# Altium schematic sheet Main_2026-02-16.schdoc
size 563 x 357 mm
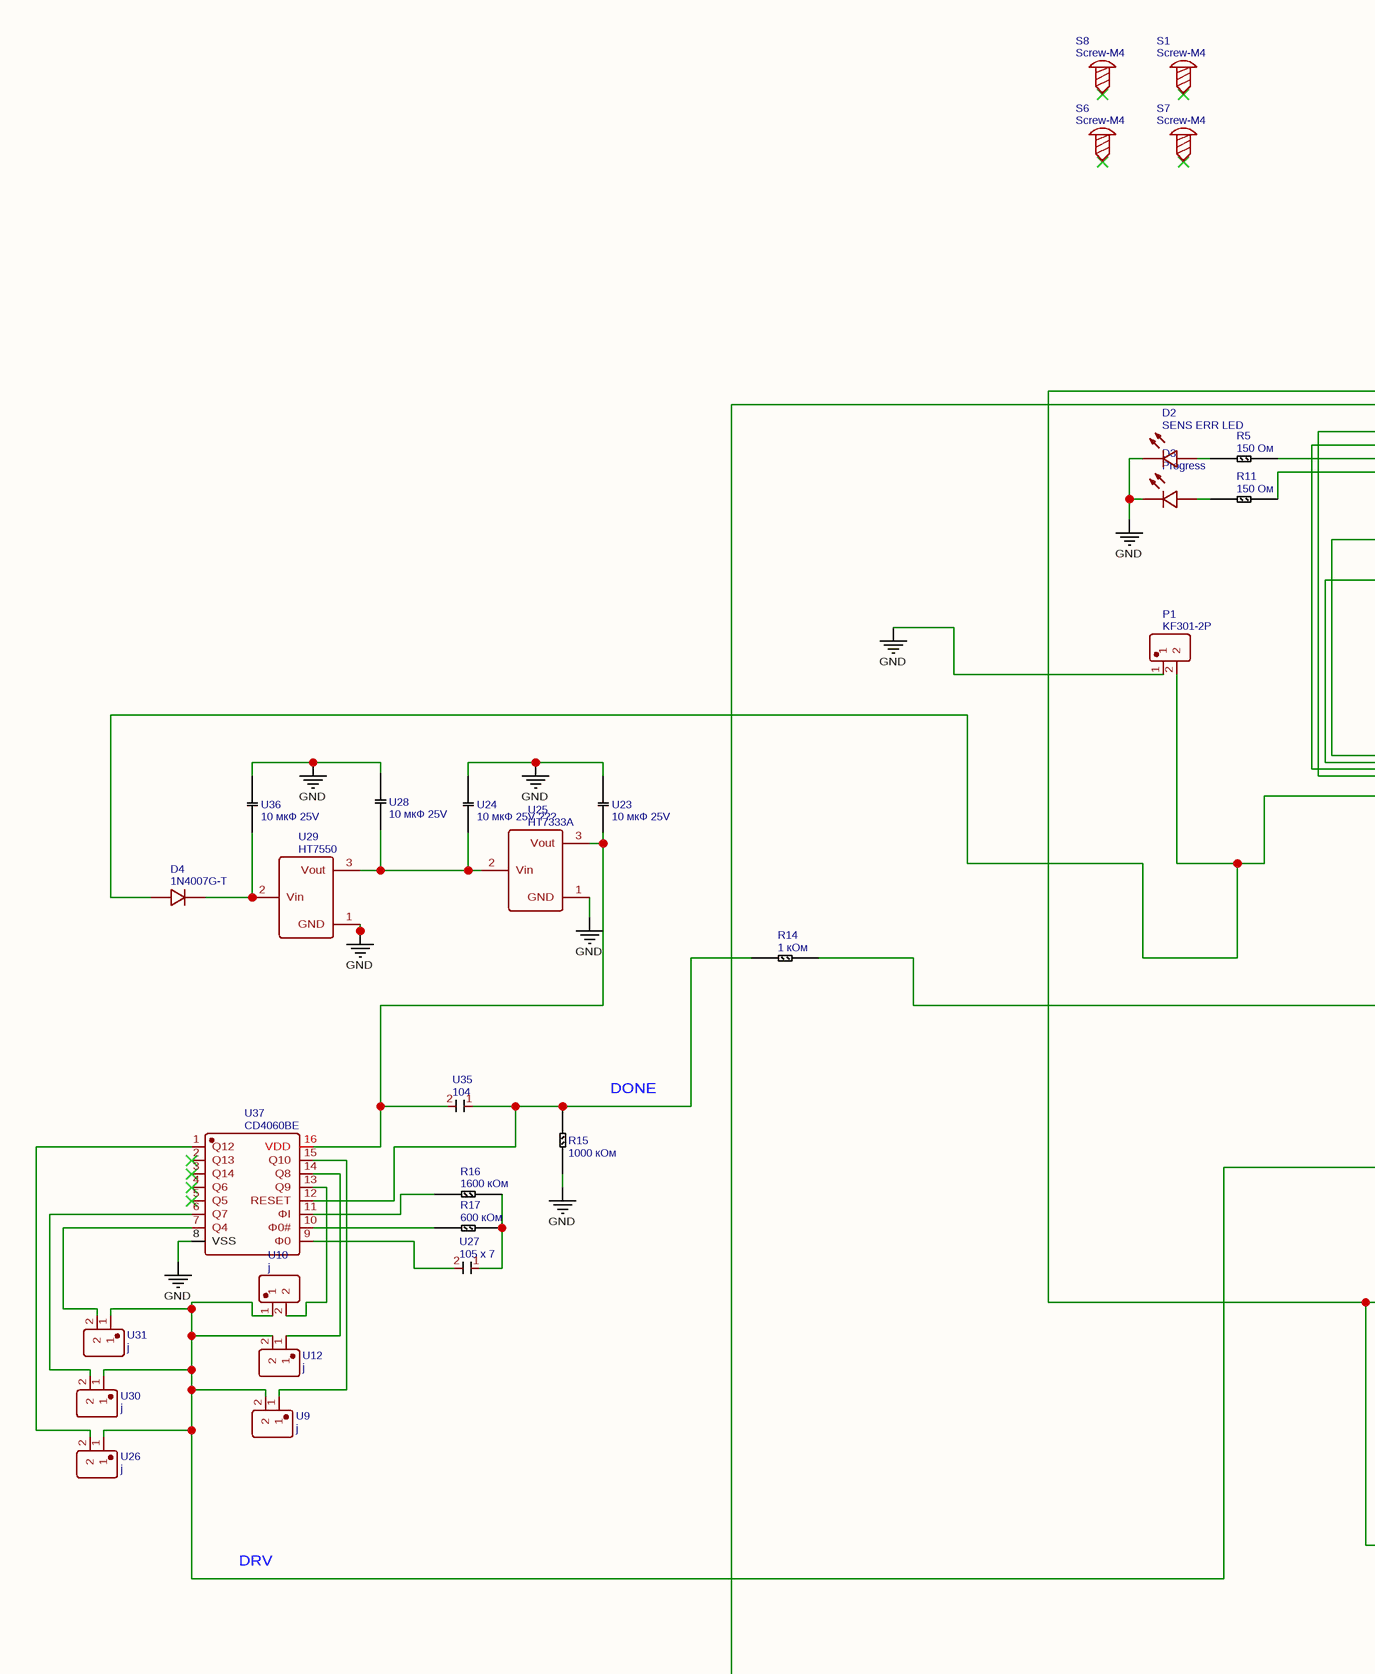
[diagram p0: Main_2026-02-16.schdoc, left]
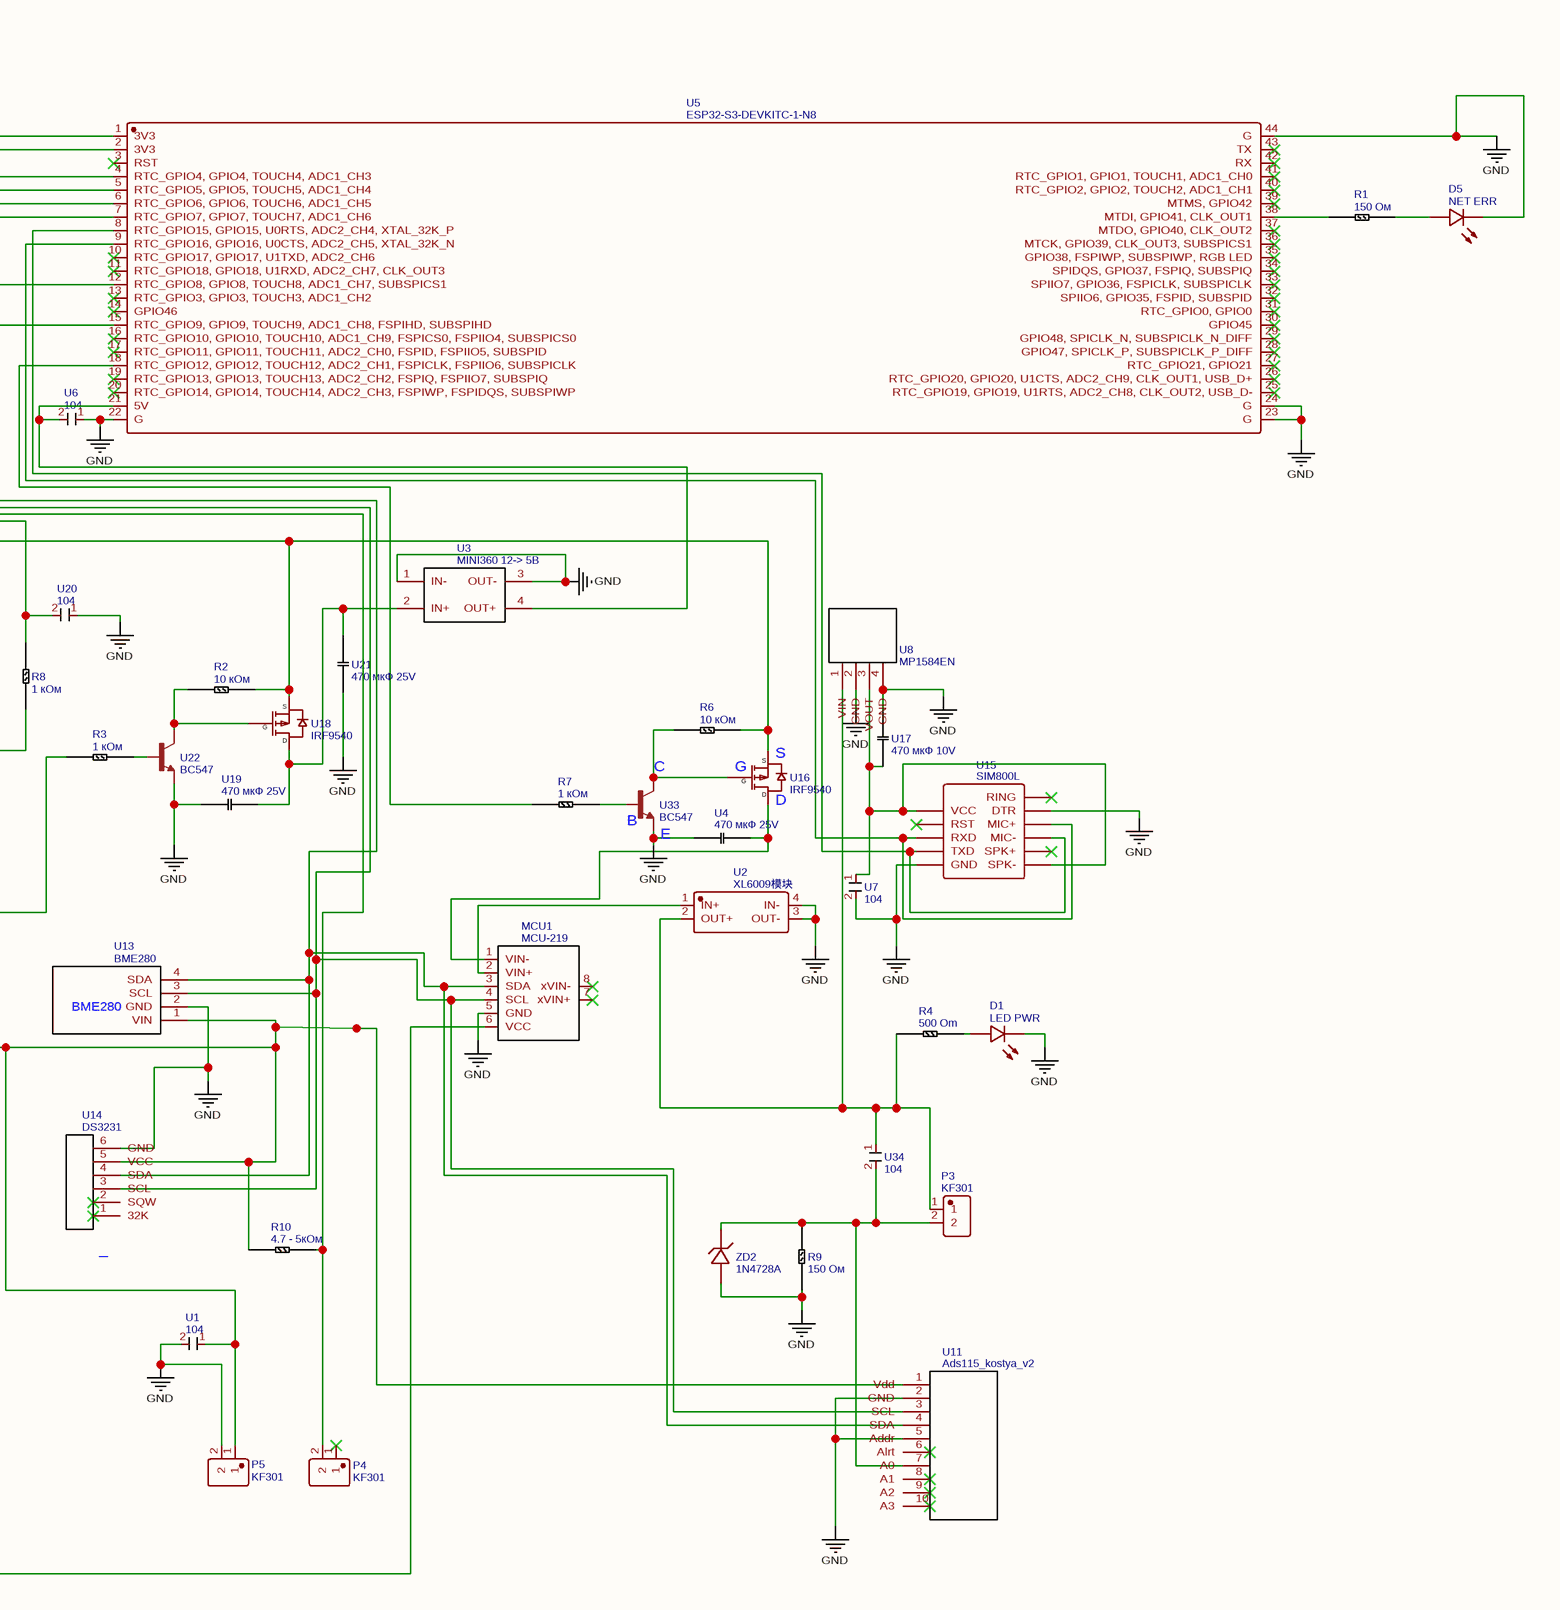
[diagram p1: Main_2026-02-16.schdoc, right]

## Parts
D1  LED PWR  [LED-TH_LED-DP2-2LED-AMCC]
D2  SENS ERR LED  [LED-TH_LED-DP2-2LED-AMCC]
D3  Progress  [LED-TH_LED-DP2-2LED-AMCC]
D4  1N4007G-T  [DO-41_BD2.4-L4.7-P8.70-D0.9-RD]
D5  NET ERR  [LED-TH_LED-DP2-2LED-AMCC]
MCU1  MCU-219  [MCU-219]
P1  KF301-2P  [CONN-TH_XY301V-A-5.0-2P]
P3  KF301  [CONN-TH_XY301V-A-5.0-2P]
P4  KF301  [CONN-TH_XY301V-A-5.0-2P]
P5  KF301  [CONN-TH_XY301V-A-5.0-2P]
R1  150 Ом  [R_0_125]
R2  10 кОм  [R_0_125]
R3  1 кОм  [R_0_125]
R4  500 Om  [R_0_125]
R5  150 Ом  [R_0_125]
R6  10 кОм  [R_0_125]
R7  1 кОм  [R_0_125]
R8  1 кОм  [R_0_125]
R9  150 Ом  [R_0_125]
R10  4.7 - 5кОм  [R_0_125]
R11  150 Ом  [R_0_125]
R14  1 кОм  [R_0_125]
R15  1000 кОм  [R_0_125]
R16  1600 кОм  [R_0_125]
R17  600 кОм  [R_0_125]
S1  Screw-M4  [SCREW-M4]
S6  Screw-M4  [SCREW-M4]
S7  Screw-M4  [SCREW-M4]
S8  Screw-M4  [SCREW-M4]
U1  104  [104]
U2  XL6009模块  [XFMR-SMD_XL6009]
U3  MINI360 12-> 5В  [MINI360BUCK]
U4  470 мкФ 25V  [C_]
U5  ESP32-S3-DEVKITC-1-N8  [CONN-TH_ESP32-S3-DEVKITC-1U-N8]
U6  104  [104]
U7  104  [104]
U8  MP1584EN  [MP1584EN]
U9  j  [HDR-TH_2P-P2.54-V-M-1]
U10  j  [HDR-TH_2P-P2.54-V-M-1]
U11  Ads115_kostya_v2  [ADS1115_KOSTYA_V2]
U12  j  [HDR-TH_2P-P2.54-V-M-1]
U13  BME280  [BME280]
U14  DS3231  [DS3231]
U15  SIM800L  [SIM800L]
U16  IRF9540  [IRF9540]
U17  470 мкФ 10V  [C_]
U18  IRF9540  [IRF9540]
U19  470 мкФ 25V  [C_]
U20  104  [104]
U21  470 мкФ 25V  [C_]
U22  BC547  [BC547 (2)]
U23  10 мкФ 25V  [C_]
U24  10 мкФ 25V ???  [C_]
U25  HT7333A  [TO-92-3_L4.9-W3.7-P1.27-L]
U26  j  [HDR-TH_2P-P2.54-V-M-1]
U27  105 x 7  [104]
U28  10 мкФ 25V  [C_]
U29  HT7550  [TO-92-3_L4.9-W3.7-P1.27-L]
U30  j  [HDR-TH_2P-P2.54-V-M-1]
U31  j  [HDR-TH_2P-P2.54-V-M-1]
U33  BC547  [BC547 (2)]
U34  104  [104]
U35  104  [104]
U36  10 мкФ 25V  [C_]
U37  CD4060BE  [PDIP-16_L19.3-W6.5-P2.54-LS7.6-BL]
ZD2  1N4728A  [DO-41_BD2.8-L4.2-P8.00-D0.7-FD]

## Nets
GND: D1.2(K) D2.2(K) D3.2(K) D5.2(K) MCU1.5(GND) P1.1 P5.2 R9.2 R15.1 U1.2 U2.3(OUT-) U2.4(IN-) U3.1(IN-) U3.3(OUT-) U4.1 U5.22(G) U5.23(G) U5.24(G) U5.44(G) U6.1 U7.2 U8.2(GND) U8.4(GND) U11.2(GND) U11.5(Addr) U13.2(GND) U14.6(GND) U15.5(GND) U15.10(DTR) U17.1 U19.1 U20.1 U21.2 U22.3(E) U23.1 U24.1 U25.1(GND) U28.2 U29.1(GND) U33.3(E) U36.1 U37.8(VSS) ZD2.1(A)
NetD1_1: D1.1(A) R4.1
NetD2_1: D2.1(A) R5.1
NetD3_1: D3.1(A) R11.1
NetD4_1: D4.1(K) U29.2(Vin) U36.2
NetD4_2: D4.2(A) P1.2 R2.2 R6.2 U16.3(S) U18.3(S)
NetD5_1: D5.1(A) R1.2
NetMCU1_1: MCU1.1(VIN-) U4.2 U16.2(D)
NetMCU1_2: MCU1.2(VIN+) U2.1(IN+)
NetMCU1_3: MCU1.3(SDA) MCU1.4(SCL) P4.2 R8.1 R10.1 R11.2 U5.4(RTC_GPIO4,_GPIO4,_TOUCH4,_ADC1_CH3) U5.5(RTC_GPIO5,_GPIO5,_TOUCH5,_ADC1_CH4) U5.7(RTC_GPIO7,_GPIO7,_TOUCH7,_ADC1_CH6) U5.12(RTC_GPIO8,_GPIO8,_TOUCH8,_ADC1_CH7,_SUBSPICS1) U5.15(RTC_GPIO9,_GPIO9,_TOUCH9,_ADC1_CH8,_FSPIHD,_SUBSPIHD) U11.3(SCL) U11.4(SDA) U13.3(SCL) U13.4(SDA) U14.3(SCL) U14.4(SDA) U20.2
NetMCU1_6: MCU1.6(VCC) U5.2(3V3)
NetP3_1: P3.1 R4.2 U2.2(OUT+) U8.1(VIN) U34.1
NetP3_2: P3.2 R9.1 U11.7(A0) U34.2 ZD2.2(K)
NetP5_1: P5.1 R10.2 U1.1 U5.1(3V3) U11.1(Vdd) U13.1(VIN) U14.5(VCC)
NetR1_1: R1.1 U5.38(MTDI,_GPIO41,_CLK_OUT1)
NetR2_1: R2.1 U18.1(G) U22.1(C)
NetR3_1: R3.1 U9.2 U10.1 U12.2 U26.1 U30.1 U31.1
NetR3_2: R3.2 U22.2(B)
NetR5_2: R5.2 U5.6(RTC_GPIO6,_GPIO6,_TOUCH6,_ADC1_CH5)
NetR6_1: R6.1 U16.1(G) U33.1(C)
NetR7_1: R7.1 U5.18(RTC_GPIO12,_GPIO12,_TOUCH12,_ADC2_CH1,_FSPICLK,_FSPIIO6,_SUBSPICLK)
NetR7_2: R7.2 U33.2(B)
NetR8_2: R8.2 R14.2
NetR14_1: R14.1 R15.2 U35.1 U37.12(RESET)
NetR16_1: R16.1 U37.11(ΦI)
NetR16_2: R16.2 R17.2 U27.1
NetR17_1: R17.1 U37.10(Φ0#)
NetU3_2: U3.2(IN+) U18.2(D) U19.2 U21.1
NetU3_4: U3.4(OUT+) U5.21(5V) U6.2
NetU5_8: U5.8(RTC_GPIO15,_GPIO15,_U0RTS,_ADC2_CH4,_XTAL_32K_P) U15.4(TXD) U15.8(MIC-)
NetU5_9: U5.9(RTC_GPIO16,_GPIO16,_U0CTS,_ADC2_CH5,_XTAL_32K_N) U15.3(RXD) U15.9(MIC+)
NetU7_1: U7.1 U8.3(VOUT) U15.1(VCC) U15.6(SPK-) U17.2
NetU9_1: U9.1 U37.15(Q10)
NetU10_2: U10.2 U37.13(Q9)
NetU12_1: U12.1 U37.14(Q8)
NetU23_2: U23.2 U25.3(Vout) U35.2 U37.16(VDD)
NetU24_2: U24.2 U25.2(Vin) U28.1 U29.3(Vout)
NetU26_2: U26.2 U37.1(Q12)
NetU27_2: U27.2 U37.9(Φ0)
NetU30_2: U30.2 U37.6(Q7)
NetU31_2: U31.2 U37.7(Q4)

Not connected (* = marked no-connect by the designer): MCU1 7(xVIN+)* 8(xVIN-)*; P4 1*; S1 1*; S6 1*; S7 1*; S8 1*; U5 3(RST)* 10(RTC_GPIO17,_GPIO17,_U1TXD,_ADC2_CH6)* 11(RTC_GPIO18,_GPIO18,_U1RXD,_ADC2_CH7,_CLK_OUT3)* 13(RTC_GPIO3,_GPIO3,_TOUCH3,_ADC1_CH2)* 14(GPIO46)* 16(RTC_GPIO10,_GPIO10,_TOUCH10,_ADC1_CH9,_FSPICS0,_FSPIIO4,_SUBSPICS0)* 17(RTC_GPIO11,_GPIO11,_TOUCH11,_ADC2_CH0,_FSPID,_FSPIIO5,_SUBSPID)* 19(RTC_GPIO13,_GPIO13,_TOUCH13,_ADC2_CH2,_FSPIQ,_FSPIIO7,_SUBSPIQ)* 20(RTC_GPIO14,_GPIO14,_TOUCH14,_ADC2_CH3,_FSPIWP,_FSPIDQS,_SUBSPIWP)* 25(RTC_GPIO19,_GPIO19,_U1RTS,_ADC2_CH8,_CLK_OUT2,_USB_D-)* 26(RTC_GPIO20,_GPIO20,_U1CTS,_ADC2_CH9,_CLK_OUT1,_USB_D+)* 27(RTC_GPIO21,_GPIO21)* 28(GPIO47,_SPICLK_P,_SUBSPICLK_P_DIFF)* 29(GPIO48,_SPICLK_N,_SUBSPICLK_N_DIFF)* 30(GPIO45)* 31(RTC_GPIO0,_GPIO0)* 32(SPIIO6,_GPIO35,_FSPID,_SUBSPID)* 33(SPIIO7,_GPIO36,_FSPICLK,_SUBSPICLK)* 34(SPIDQS,_GPIO37,_FSPIQ,_SUBSPIQ)* 35(GPIO38,_FSPIWP,_SUBSPIWP,_RGB_LED)* 36(MTCK,_GPIO39,_CLK_OUT3,_SUBSPICS1)* 37(MTDO,_GPIO40,_CLK_OUT2)* 39(MTMS,_GPIO42)* 40(RTC_GPIO2,_GPIO2,_TOUCH2,_ADC1_CH1)* 41(RTC_GPIO1,_GPIO1,_TOUCH1,_ADC1_CH0)* 42(RX)* 43(TX)*; U11 6(Alrt)* 8(A1)* 9(A2)* 10(A3)*; U14 1(32K)* 2(SQW)*; U15 2(RST)* 7(SPK+)* 11(RING)*; U37 2(Q13)* 3(Q14)* 4(Q6)* 5(Q5)*

## Notes on the sheet
- (near U33) C
- (near U16) G
- (near U16) S
- DONE
- (near U33) B
- (near U33) E
- (near U16) D
- DRV
- (in symbol DS3231) _

## Library data of the parts
D1 = LED PWR: Manufacturer: VccLite; Manufacturer Part: 5600; Contributor: urbanturban; Package Display: No; Supplier: Digi-Key; Supplier Part: L20325-ND; link: https://vcclite.com/product/5602f5-5v/; spicePre: D; spiceSymbolName: LED
D2 = SENS ERR LED: Manufacturer: VccLite; Manufacturer Part: 5600; Contributor: urbanturban; Package Display: No; Supplier: Digi-Key; Supplier Part: L20325-ND; link: https://vcclite.com/product/5602f5-5v/; spicePre: D; spiceSymbolName: LED
D3 = Progress: Manufacturer: VccLite; Manufacturer Part: 5600; Contributor: urbanturban; Package Display: No; Supplier: Digi-Key; Supplier Part: L20325-ND; link: https://vcclite.com/product/5602f5-5v/; spicePre: D; spiceSymbolName: LED
D4 = 1N4007G-T: Manufacturer: DIODES(美台); Contributor: LCSC; Supplier: LCSC; Supplier Part: C516593; Manufacturer Part: 1N4007G-T; JLCPCB Part Class: Extended Part; spicePre: D; spiceSymbolName: 1N4007G-T
D5 = NET ERR: Manufacturer: VccLite; Manufacturer Part: 5600; Contributor: urbanturban; Package Display: No; Supplier: Digi-Key; Supplier Part: L20325-ND; link: https://vcclite.com/product/5602f5-5v/; spicePre: D; spiceSymbolName: LED
MCU1 = MCU-219: Contributor: ziclope; spicePre: M; spiceSymbolName: MCU-219
P1 = KF301-2P: Manufacturer: null; Manufacturer Part: KF301-2P接线端子; Contributor: lcsc; Supplier: LCSC; Supplier Part: C9900016950; JLCPCB Part Class: Extended Part; spicePre: P; spiceSymbolName: KF301-2P VCC Y GND
P3-P5 = KF301: Manufacturer: null; Manufacturer Part: KF301-2P接线端子; Contributor: lcsc; Supplier: LCSC; Supplier Part: C9900016950; JLCPCB Part Class: Extended Part; spicePre: P; spiceSymbolName: KF301-2P VCC Y GND
R1 R5 R9 R11 = 150 Ом: Contributor: verdenum; spicePre: U; spiceSymbolName: R_
R2 R6 = 10 кОм: Contributor: verdenum; spicePre: U; spiceSymbolName: R_
R3 R7 R8 R14 = 1 кОм: Contributor: verdenum; spicePre: U; spiceSymbolName: R_
R4 = 500 Om: Contributor: verdenum; spicePre: U; spiceSymbolName: R_
R10 = 4.7 - 5кОм: Contributor: verdenum; spicePre: U; spiceSymbolName: R_
R15 = 1000 кОм: Contributor: verdenum; spicePre: U; spiceSymbolName: R_
R16 = 1600 кОм: Contributor: verdenum; spicePre: U; spiceSymbolName: R_
R17 = 600 кОм: Contributor: verdenum; spicePre: U; spiceSymbolName: R_
S1 S6-S8 = Screw-M4: Contributor: EasyEDA; spicePre: S; spiceSymbolName: Screw-M4
U1 U6 U7 U20 U34 U35 = 104: Manufacturer: Fe; Contributor: Guest; Manufacturer Part: 104; Supplier Part: 104; spicePre: U; spiceSymbolName: 104
U2 = XL6009模块: Manufacturer: null; Contributor: LCSC; Supplier: LCSC; Supplier Part: C2908146; Manufacturer Part: xl6009模块; JLCPCB Part Class: Extended Part; spicePre: U; spiceSymbolName: XL6009模块
U3 = MINI360 12-> 5В: Contributor: Andrey Fedorov; sourceId: FRLFXR8qI; timeStamp: 1471372851; Manufacturer Part: Mini360; link: http://ali.pub/399f0z; spicePre: U; spiceSymbolName: MINI360BUCK
U4 U19 U21 = 470 мкФ 25V: Contributor: verdenum; spicePre: U; spiceSymbolName: C_
U5 = ESP32-S3-DEVKITC-1-N8: Manufacturer: ESPRESSIF(乐鑫); Contributor: lcsc; Supplier: LCSC; Supplier Part: C20438410; Manufacturer Part: ESP32-S3-DEVKITC-1-N8; JLCPCB Part Class: Extended Part; spicePre: U; spiceSymbolName: ESP32-S3-DEVKITC-1-N8
U8 = MP1584EN: Contributor: babeinlovexd; spicePre: U; spiceSymbolName: MP1584EN
U9 U10 U12 U26 U30 U31 = j: Manufacturer: null; Manufacturer Part: Jumper2; Contributor: LCSC; Supplier: LCSC; Supplier Part: C2940092; JLCPCB Part Class: Extended Part; spicePre: U; spiceSymbolName: JUMPER2
U11 = Ads115_kostya_v2: Contributor: corlov; spicePre: U; spiceSymbolName: Ads115_kostya_v2
U13 = BME280: Contributor: allvex; spicePre: U; spiceSymbolName: BME280
U14 = DS3231: Contributor: poljak1141leonardo; spicePre: U; spiceSymbolName: DS3231 upright
U15 = SIM800L: Contributor: Rafa_2122; spicePre: U; spiceSymbolName: SIM800L
U16 U18 = IRF9540: Contributor: alesmo; spicePre: U; spiceSymbolName: IRF9540
U17 = 470 мкФ 10V: Contributor: verdenum; spicePre: U; spiceSymbolName: C_
U22 U33 = BC547: Contributor: joaodahlke; spicePre: U; spiceSymbolName: BC547
U23 U28 U36 = 10 мкФ 25V: Contributor: verdenum; spicePre: U; spiceSymbolName: C_
U24 = 10 мкФ 25V ???: Contributor: verdenum; spicePre: U; spiceSymbolName: C_
U25 = HT7333A: Manufacturer: HOLTEK(合泰/盛群); Manufacturer Part: HT7550-1; Supplier: LCSC; Supplier Part: C18333; JLCPCB Part Class: Extended Part; spicePre: U; spiceSymbolName: HT7550-1_C18333
U27 = 105 x 7: Manufacturer: Fe; Contributor: Guest; Manufacturer Part: 104; Supplier Part: 104; spicePre: U; spiceSymbolName: 104
U29 = HT7550: Manufacturer: HOLTEK(合泰/盛群); Manufacturer Part: HT7550-1; Supplier: LCSC; Supplier Part: C18333; JLCPCB Part Class: Extended Part; spicePre: U; spiceSymbolName: HT7550-1_C18333
U37 = CD4060BE: Manufacturer: TI(德州仪器); spicePre: X; Supplier: LCSC; Manufacturer Part: CD4060BE; Supplier Part: C5198; JLCPCB Part Class: Extended Part; spiceSymbolName: CD4060BE
ZD2 = 1N4728A: Manufacturer: ST(先科); Supplier: LCSC; Manufacturer Part: 1N4728A; Supplier Part: C2531; JLCPCB Part Class: Extended Part; spicePre: Z; spiceSymbolName: 1N4728A